# EAGLE design drone_V2 (EAGLE 7.5.0)
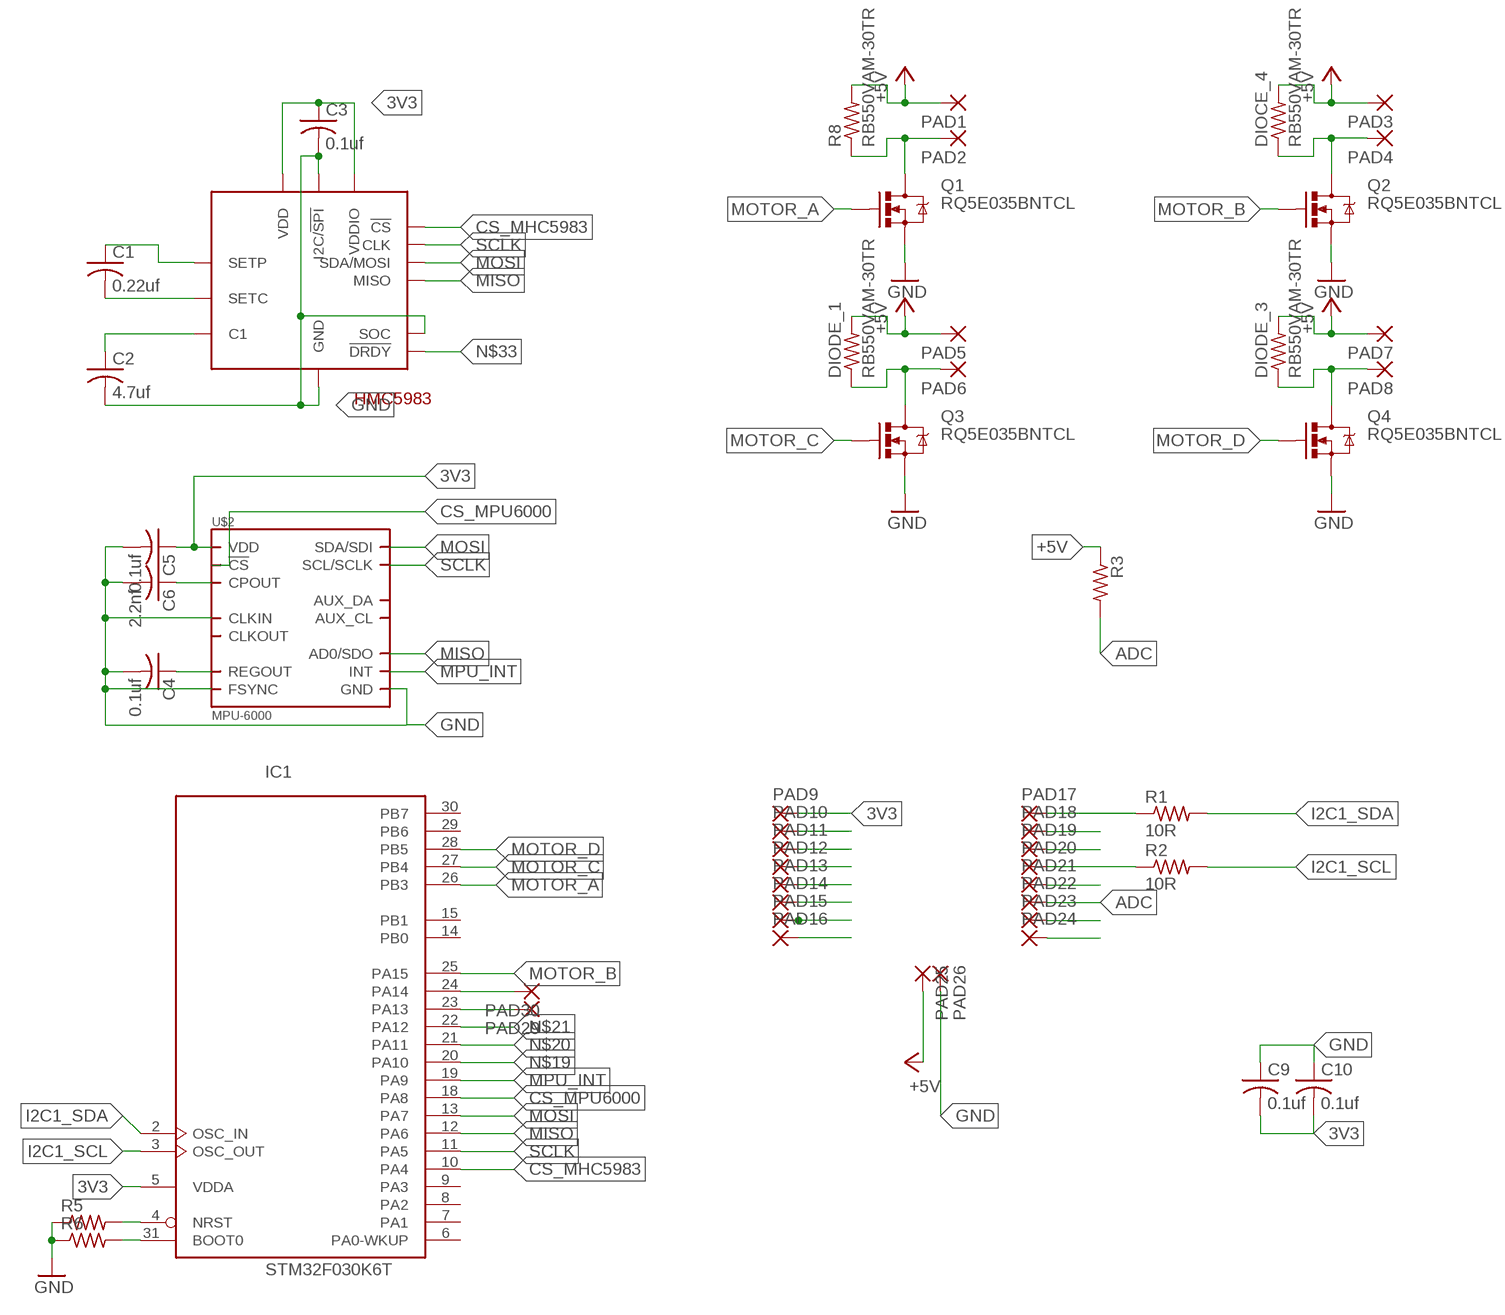
[diagram p0: schematic, sheet 1]

## Parts
C1  0.22uf  C-USC0805K  [C0805K]
C2  4.7uf  C-USC1206  [C1206]
C3  0.1uf  C-USC0805K  [C0805K]
C4  0.1uf  C-USC0805K  [C0805K]
C5  0.1uf  C-USC0805K  [C0805K]
C6  2.2nf  C-USC0805K  [C0805K]
C9  0.1uf  C-USC0805K  [C0805K]
C10  0.1uf  C-USC0805K  [C0805K]
DIOCE_4  RB550VAM-30TR  R-US_R0805  [R0805]
DIODE_1  RB550VAM-30TR  R-US_R0805  [R0805]
DIODE_3  RB550VAM-30TR  R-US_R0805  [R0805]
HMC5983  HMC5983  [LPCC16]
IC1  STM32F030K6T  [LQFP32]
PAD1  1,6/0,8  [1,6/0,8]
PAD2  1,6/0,8  [1,6/0,8]
PAD3  1,6/0,8  [1,6/0,8]
PAD4  1,6/0,8  [1,6/0,8]
PAD5  1,6/0,8  [1,6/0,8]
PAD6  1,6/0,8  [1,6/0,8]
PAD7  1,6/0,8  [1,6/0,8]
PAD8  1,6/0,8  [1,6/0,8]
PAD9  1,6/0,9  [1,6/0,9]
PAD10  1,6/0,9  [1,6/0,9]
PAD11  1,6/0,9  [1,6/0,9]
PAD12  1,6/0,9  [1,6/0,9]
PAD13  1,6/0,9  [1,6/0,9]
PAD14  1,6/0,9  [1,6/0,9]
PAD15  1,6/0,9  [1,6/0,9]
PAD16  1,6/0,9  [1,6/0,9]
PAD17  1,6/0,9  [1,6/0,9]
PAD18  1,6/0,9  [1,6/0,9]
PAD19  1,6/0,9  [1,6/0,9]
PAD20  1,6/0,9  [1,6/0,9]
PAD21  1,6/0,9  [1,6/0,9]
PAD22  1,6/0,9  [1,6/0,9]
PAD23  1,6/0,9  [1,6/0,9]
PAD24  1,6/0,9  [1,6/0,9]
PAD25  1,6/0,9  [1,6/0,9]
PAD26  1,6/0,9  [1,6/0,9]
PAD29  1,6/0,9  [1,6/0,9]
PAD30  1,6/0,9  [1,6/0,9]
Q1  RQ5E035BNTCL  MOSFET-NCHANNELSMD  [SOT23-3]
Q2  RQ5E035BNTCL  MOSFET-NCHANNELSMD  [SOT23-3]
Q3  RQ5E035BNTCL  MOSFET-NCHANNELSMD  [SOT23-3]
Q4  RQ5E035BNTCL  MOSFET-NCHANNELSMD  [SOT23-3]
R1  10R  R-US_R0805  [R0805]
R2  10R  R-US_R0805  [R0805]
R3  R-US_R0805  [R0805]
R5  R-US_R0805  [R0805]
R6  R-US_R0805  [R0805]
R8  RB550VAM-30TR  R-US_R0805  [R0805]
U$2  MPU-6000  [QFN.24.4X4]

## Nets
3V3: C3.1 C5.1 C9.2 C10.2 HMC5983.P$2(VDD) HMC5983.P$13(VDDIO) IC1.5(VDDA) PAD9.1(P) U$2.13(VDD)
+5V: DIOCE_4.2 DIODE_1.2 DIODE_3.2 PAD1.1(P) PAD3.1(P) PAD5.1(P) PAD7.1(P) PAD25.1(P) R3.1 R8.2
ADC: PAD22.1(P) R3.2
CS_MHC5983: HMC5983.P$4(!CS) IC1.10(PA4)
CS_MPU6000: IC1.18(PA8) U$2.8(!CS)
DIODE_2: PAD2.1(P) Q1.3(D) R8.1
GND: C2.2 C3.2 C4.2 C5.2 C6.2 C9.1 C10.1 HMC5983.P$6(I2C/!SPI) HMC5983.P$9(SOC) HMC5983.P$11(GND) PAD24.1(P) PAD26.1(P) Q1.2(S) Q2.2(S) Q3.2(S) Q4.2(S) R5.1 R6.1 U$2.1(CLKIN) U$2.11(FSYNC) U$2.18(GND)
I2C1_SCL: IC1.3(OSC_OUT) R2.2
I2C1_SDA: IC1.2(OSC_IN) R1.2
MISO: HMC5983.P$5(MISO) IC1.12(PA6) U$2.9(AD0/SDO)
MOSI: HMC5983.P$16(SDA/MOSI) IC1.13(PA7) U$2.24(SDA/SDI)
MOTOR_A: IC1.26(PB3) Q1.1(G)
MOTOR_B: IC1.25(PA15) Q2.1(G)
MOTOR_C: IC1.27(PB4) Q3.1(G)
MOTOR_D: IC1.28(PB5) Q4.1(G)
MPU_INT: IC1.19(PA9) U$2.12(INT)
N$3: DIODE_1.1 PAD6.1(P) Q3.3(D)
N$4: DIODE_3.1 PAD8.1(P) Q4.3(D)
N$5: DIOCE_4.1 PAD4.1(P) Q2.3(D)
N$6: IC1.4(NRST) R5.2
N$7: IC1.31(BOOT0) R6.2
N$8: PAD23.1(P)
N$11: C4.1 U$2.10(REGOUT)
N$13: PAD21.1(P)
N$14: PAD17.1(P) R1.1
N$15: PAD19.1(P)
N$16: PAD18.1(P)
N$17: PAD20.1(P) R2.1
N$18: PAD16.1(P)
N$19: IC1.20(PA10)
N$20: IC1.21(PA11)
N$21: IC1.22(PA12)
N$22: IC1.23(PA13) PAD29.1(P)
N$23: IC1.24(PA14) PAD30.1(P)
N$25: PAD15.1(P)
N$26: PAD14.1(P)
N$27: PAD13.1(P)
N$28: PAD12.1(P)
N$29: PAD11.1(P)
N$30: PAD10.1(P)
N$33: HMC5983.P$15(!DRDY)
N$35: C1.2 HMC5983.P$12(SETC)
N$36: C1.1 HMC5983.P$8(SETP)
N$38: C2.1 HMC5983.P$10(C1)
N$40: C6.1 U$2.20(CPOUT)
SCLK: HMC5983.P$1(CLK) IC1.11(PA5) U$2.23(SCL/SCLK)
Unconnected: IC1.6(PA0-WKUP) IC1.7(PA1) IC1.8(PA2) IC1.9(PA3) IC1.14(PB0) IC1.15(PB1) IC1.29(PB6) IC1.30(PB7) U$2.6(AUX_DA) U$2.7(AUX_CL) U$2.22(CLKOUT)

## Power pins joined to a net without a drawn wire
3V3: IC1.1(VDD) IC1.17(VDD)
GND: IC1.16(VSS) IC1.32(VSS)

## Library data of the parts
C1-C6 C9 C10 = adafruit:C-US: CAPACITOR, American symbol
DIOCE_4 DIODE_1 DIODE_3 R8 = adafruit:R-US_: RESISTOR, American symbol
HMC5983 = Oles komponentbibliotek:HMC5983: 3-Axis Digital Compass IC I²C up to 3.4 MHz and SPI up to 8.0 MHz 220 Hz Maximum Output Rate 2.16 to 3.6V, 100 μA Temperature compensated data output and temperature output 12-Bit ADC achieves 2 milli-gauss field resolution Wide Magnetic Field Range (+/-8 Oe)
IC1 = micro-stm_v3:STM32F030K*T: ARM 32-bit Cortex™-M0 CPU 48 MHz maximum frequency 32 Kbytes of Flash memory 4 kbytes of SRAM 26 GPIOs 2.4 to 3.6 V application supply
PAD1-PAD8 = wirepad_ext:1,6/0,8: THROUGH-HOLE PAD
PAD9-PAD26 PAD29 PAD30 = wirepad_ext:1,6/0,9: THROUGH-HOLE PAD
Q1-Q4 = SparkFun:MOSFET-NCHANNEL
R1-R3 R5 R6 = resistor:R-US_: RESISTOR, American symbol
U$2 = invensense:MPU-6000

## Board
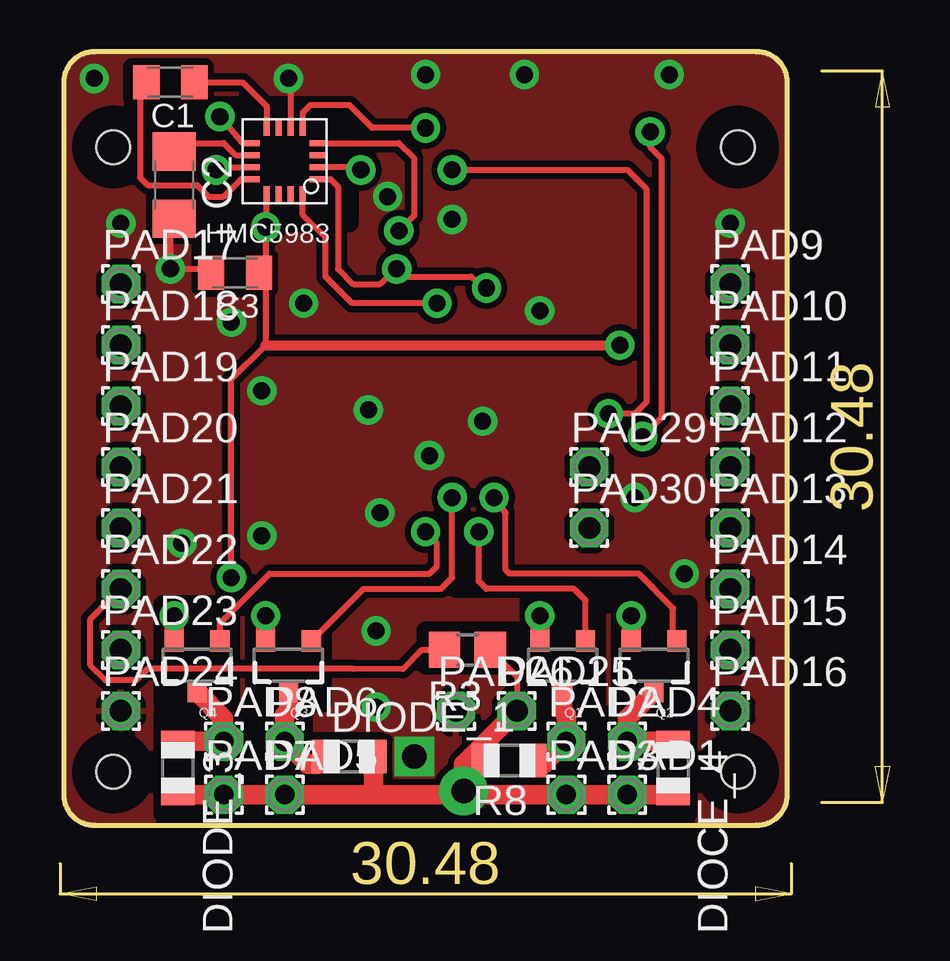
[diagram p1: board, top side]
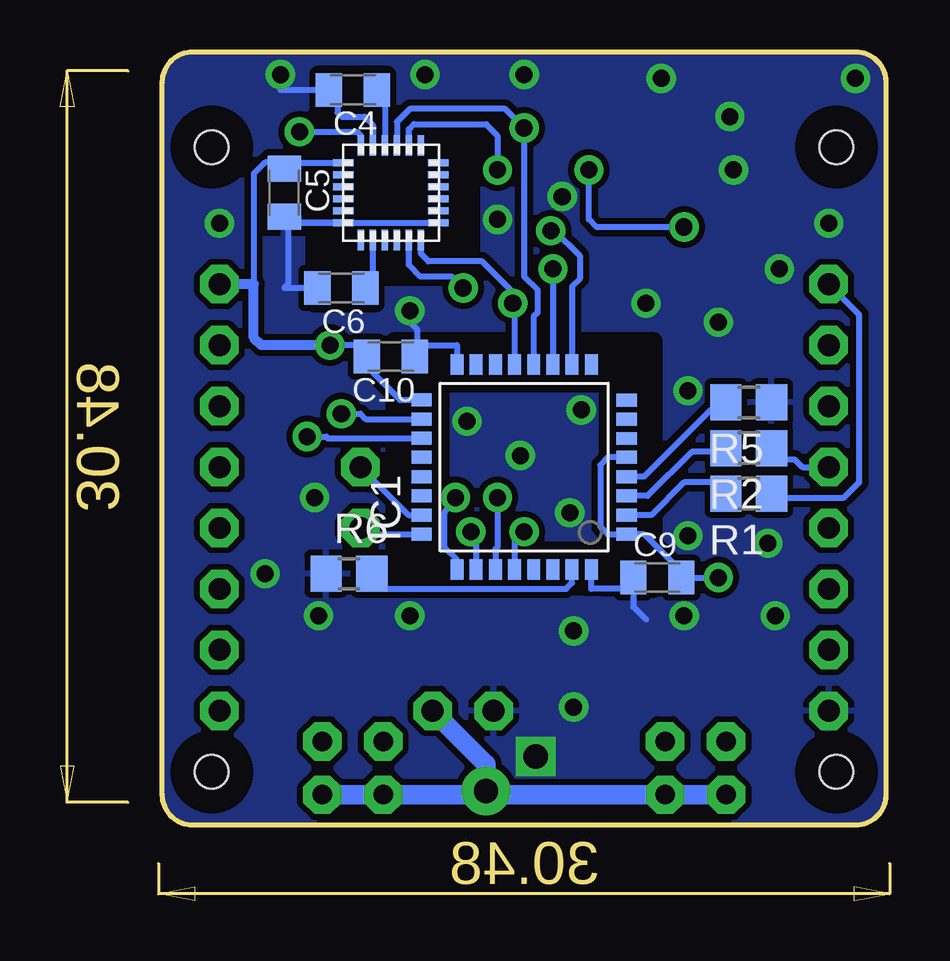
[diagram p2: board, bottom side, seen from below]

Size 34.59 x 34.59 mm. Coordinates in mm from the lower left corner, seen from the top.
Copper layers (1*16): Top 0.035mm / dielectric 1.5mm / Bottom 0.035mm
Design rules "default *": minimum track width 10mil, minimum drill 0.7mm, track to track 10mil, track to pad 10mil, pad to pad 10mil, via to via 10mil, smd to smd 10mil, copper to edge 40mil, drill to drill 8mil, minimum pad ring 10mil, minimum via ring 8mil, stop-mask expansion 4mil, vias tented up to drill 0mil, thermal gap 10mil
Holes 1.4 mm at 2.22,5.38 28.26,5.38 28.26,31.42 2.22,31.42
tRestrict: area 6.3,28.2 to 12.1,33.2; area 4,27.8 to 7.8,33; area 3,33.5 to 6,34.7; area 5.9,25.5 to 8.6,27.1; area 4.3,8.2 to 7.1,12.4; area 8.1,8.2 to 12.5,13.6; area 15.2,9.8 to 18.9,11.3; area 19.5,8.2 to 25.4,13.6; area 23.3,8.2 to 26.2,12.4; area 4.3,3.6 to 13.3,7.8; area 17.1,3.6 to 26.2,7.8; area 16.5,13 to 18.6,15.7; area 12.2,24.9 to 16.2,26.3; area 12.9,3.2 to 17.3,4
bRestrict: area 15.2,26 to 24,32.7; area 21,33.2 to 23.8,34.4; area 24.6,28.6 to 25.9,30.9; area 21.4,24.9 to 24,26.2; area 9.8,13 to 20.6,23.3; area 7,3.2 to 23.5,4
Milling: 8 lines

### Footprints (pad centres in the part's own frame; a part is rotated, then mirrored left to right if it is on the bottom)
C0805K = smd 1.1 x 1.4: 1 -1,0; 2 1,0
C1206 = smd 1.6 x 1.8: 1 -1.4,0; 2 1.4,0
R0805 = smd 1.1 x 1.4: 1 -1,0; 2 1,0
LPCC16 = smd 0.7 x 0.25: P$1 -1.4,0.7; P$2 -1.4,0.2; P$3 -1.4,-0.3; P$4 -1.4,-0.8; P$9 1.4,-0.8; P$10 1.4,-0.3; P$11 1.4,0.2; P$12 1.4,0.7 | smd 0.25 x 0.7: P$5 -0.75,-1.45; P$6 -0.25,-1.45; P$7 0.25,-1.45; P$8 0.75,-1.45; P$13 0.75,1.35; P$14 0.25,1.35; P$15 -0.25,1.35; P$16 -0.75,1.35
LQFP32 = smd 0.54 x 0.85: 1 -2.8,-4.275; 2 -2,-4.275; 3 -1.2,-4.275; 4 -0.4,-4.275; 5 0.4,-4.275; 6 1.19,-4.275; 7 1.99,-4.275; 8 2.79,-4.275; 17 2.8,4.275; 18 2,4.275; 19 1.2,4.275; 20 0.4,4.275; 21 -0.4,4.275; 22 -1.2,4.275; 23 -2,4.275; 24 -2.8,4.275 | smd 0.85 x 0.54: 9 4.275,-2.8; 10 4.275,-2; 11 4.275,-1.2; 12 4.275,-0.4; 13 4.275,0.4; 14 4.275,1.2; 15 4.275,2; 16 4.275,2.8; 25 -4.275,2.8; 26 -4.275,2; 27 -4.275,1.2; 28 -4.275,0.4; 29 -4.275,-0.4; 30 -4.275,-1.2; 31 -4.275,-2; 32 -4.275,-2.8
1,6/0,8 = drill 0.813 pad 1.6 octagon: 1 0,0
1,6/0,9 = drill 0.914 pad 1.6 octagon: 1 0,0
SOT23-3 = smd 0.8 x 0.9: 1 -0.95,-1; 2 0.95,-1; 3 0,1.1
R0805' = smd 1.3 x 1.5: 1 -0.95,0; 2 0.95,0
QFN.24.4X4 = smd 0.85 x 0.28: 1 -1.975,1.25; 2 -1.975,0.75; 3 -1.975,0.25; 4 -1.975,-0.25; 5 -1.975,-0.75; 6 -1.975,-1.25; 13 1.975,-1.25; 14 1.975,-0.75; 15 1.975,-0.25; 16 1.975,0.25; 17 1.975,0.75; 18 1.975,1.25 | smd 0.28 x 0.85: 7 -1.25,-1.975; 8 -0.75,-1.975; 9 -0.25,-1.975; 10 0.25,-1.975; 11 0.75,-1.975; 12 1.25,-1.975; 19 1.25,1.975; 20 0.75,1.975; 21 0.25,1.975; 22 -0.25,1.975; 23 -0.75,1.975; 24 -1.25,1.975

### Placement (x,y rotation side)
C1  4.6,34.11 180 top
C2  4.76,29.83 270 top
C3  7.3,26.18 180 top
C4  22.38,33.8 180 bottom
C5  25.24,29.51 270 bottom
C6  22.86,25.54 180 bottom
C9  9.68,13.48 0 bottom
C10  20.8,22.68 180 bottom
DIOCE_4  25.56,5.54 270 top
DIODE_1  12.06,6.02 0 top
DIODE_3  4.92,5.54 270 top
HMC5983  9.37,30.78 180 top
IC1  15.24,18.08 90 bottom
PAD1  23.65,4.43 0 top
PAD2  21.11,6.65 0 top
PAD3  21.11,4.43 0 top
PAD4  23.65,6.65 0 top
PAD5  9.37,4.43 0 top
PAD6  9.37,6.65 0 top
PAD7  6.83,4.43 0 top
PAD8  6.83,6.65 0 top
PAD9  27.94,25.7 0 top
PAD10  27.94,23.16 0 top
PAD11  27.94,20.62 0 top
PAD12  27.94,18.08 0 top
PAD13  27.94,15.54 0 top
PAD14  27.94,13 0 top
PAD15  27.94,10.46 0 top
PAD16  27.94,7.92 0 top
PAD17  2.54,25.7 0 top
PAD18  2.54,23.16 0 top
PAD19  2.54,20.62 0 top
PAD20  2.54,18.08 0 top
PAD21  2.54,15.54 0 top
PAD22  2.54,13 0 top
PAD23  2.54,10.46 0 top
PAD24  2.54,7.92 0 top
PAD25  19.05,7.92 0 top
PAD26  16.51,7.92 0 top
PAD29  22.07,18.08 0 top
PAD30  22.07,15.54 0 top
Q1  20.95,9.83 180 top
Q2  24.77,9.83 180 top
Q3  9.53,9.83 180 top
Q4  5.71,9.83 180 top
R1  10R  [R0805']  5.87,16.97 180 bottom
R2  10R  [R0805']  5.87,18.87 180 bottom
R3  [R0805']  16.99,10.46 180 top
R5  [R0805']  5.87,20.78 180 bottom
R6  [R0805']  22.54,13.64 0 bottom
R8  18.73,5.86 180 top
U$2  20.8,29.51 180 bottom

### Tracks (layer width: path | path; a pad name or v marks a point on that pad's centre or on a via)
3V3  (via drill 0.71 pad 1.22)
  Top 0.254: HMC5983.P$13 8.62,28.2 v8.57,28.08 8.57,26.34 8.3,26.38 C3.1 8.57,26.18 8.57,23.16 7.14,21.73 v7.14,13.48 | v12.54,30.46 12.42,30.58 HMC5983.P$2
  Top 0.406: 8.57,23.16 v23.34,23.16
  Bottom 0.254: v8.57,28.08 12.22,28.08 12.54,28.4 v12.54,30.46 | U$2.13 24.99,30.76 C5.1 25.51,30.78 26.04,30.78 26.51,30.3 26.51,25.7 | C9.2 8.89,13.95 10.22,15.28 IC1.1 11.75,15.28 12.06,15.6 12.06,18.16 11.75,18.48 IC1.5 | IC1.17 20.42,20.88 21.8,22.26 C10.2 22.27,23.16 v23.34,23.16 | C9.2 8.68,13.21 8.89,13 8.89,13.48 C9.2 | C9.2 v7.14,13.48
  Bottom 0.406: PAD9.1 26.51,25.7 26.51,23.48 26.19,23.16 v23.34,23.16
+5V  (via drill 1.02 pad 2.03)
  Top 0.254: R3.1 19.05,9.35 PAD25.1
  Top 0.61: 12.75,4.48 12.7,4.43
  Top 0.813: 16.83,4.43 13.18,4.43 | 13.18,4.43 12.7,4.43 PAD5.1 PAD7.1 4.87,4.43 DIODE_3.2 | PAD25.1 17.14,6.02 | 17.14,6.02 16.83,5.7 v16.83,4.59 16.83,4.43 | 16.83,4.43 PAD3.1 PAD1.1 25.45,4.43 DIOCE_4.2 | 17.14,6.02 17.46,5.7 17.62,5.86 R8.2 | DIODE_1.2 13.06,4.54 13.18,4.43
  Bottom 0.813: PAD25.1 16.83,5.7 v16.83,4.59 16.83,4.43 | 16.83,4.43 PAD7.1 | 16.83,4.43 PAD1.1
ADC
  Top 0.254: PAD22.1 1.27,11.73 1.27,9.83 1.91,9.19 3.17,9.19 3.65,9.67 12.22,9.67 14.29,9.66 15.08,10.46 R3.2
CS_MHC5983  (via drill 0.71 pad 1.22)
  Top 0.254: HMC5983.P$4 14.12,31.58 14.76,30.94 14.76,28.56 v14.13,27.92
  Bottom 0.254: v14.13,27.92 13.97,27.92 12.92,26.88 12.92,25.92 13.24,25.61 IC1.10
CS_MPU6000  (via drill 0.71 pad 1.22)
  Top 0.254: v16.35,30.46 23.65,30.46 24.45,29.67 24.45,20.78 23.97,20.3 v22.86,20.3
  Bottom 0.254: U$2.8 20.05,32.17 19.84,32.37 16.83,32.37 16.35,31.89 v16.35,30.46 | 19.58,20.14 IC1.18 21.84,20.08 22.07,20.3 v22.86,20.3
DIODE_2
  Top 0.254: Q1.3
  Top 0.813: Q1.3 20.95,7.92 21.11,7.76 PAD2.1 20.16,5.7 20,5.86 R8.1
GND  (via drill 0.71 pad 1.22, 1.02 pad 1.65)
  Top 0.254: v6.51,30.46 6.63,30.58 HMC5983.P$11 | v6.67,32.69 7.61,31.58 HMC5983.P$9 | v9.53,34.27 9.62,33.86 HMC5983.P$6 | C2.2 4.89,28.43 4.92,28.4 4.76,28.4 4.6,28.24 v4.6,26.34 6.19,26.34 6.3,26.45 | 6.3,26.45 6.3,26.65 | 6.3,26.45 C3.2 | v4.76,11.89 | v8.57,11.89 | v20,11.89 | v23.82,11.89 v23.81,11.89
  Top 0.813: Q4.2 v4.76,11.89 | Q3.2 v8.57,11.89 | Q1.2 v20,11.89 | Q2.2 v23.82,11.89
  Bottom 0.254: C5.2 24.99,28.26 U$2.18 | U$2.11 21.55,32.32 21.91,32.69 22.86,32.69 23.02,32.84 23.02,33.43 C4.2 25.4,33.8 v25.4,34.43 | U$2.18 U$2.1 | C9.1 10.68,13 | 10.68,13 12.44,13 IC1.32 | C10.1 19.68,22.68 19.68,23.16 | 19.68,23.16 18.04,23.16 IC1.16 | 19.68,23.16 19.68,23.8 20,24.11 v20,24.59 | 10.68,13 10.68,12.25 10.16,11.73 | U$2.18 25.06,28.26 25.08,28.24 25.08,25.7 25.24,25.54 C6.2
  other vias: 10.16,24.91 15.24,34.43 19.37,34.43 27.94,28.24 23.97,16.81 8.41,21.26 5.08,14.91 26.04,13.64 7.14,24.11 16.35,28.4 13.65,29.35 1.43,34.27 2.54,28.24 13.18,8.08 12.86,20.46 17.62,19.99 15.4,18.56 8.41,15.22 13.34,16.18 13.18,11.25 14.76,6.02
  pour Bottom (isolate 0.254): 28.89,3.32 1.59,3.32 arc-90 0.32,4.59 0.32,33.96 arc-90 1.59,35.23 28.89,35.23 arc-90 30.16,33.96 30.16,4.59 arc-90
  pour Top (isolate 0.254): 28.89,3.32 1.59,3.32 arc-90 0.32,4.59 0.32,33.96 arc-90 1.59,35.23 28.89,35.23 arc-90 30.16,33.96 30.16,4.59 arc-90
I2C1_SCL
  Bottom 0.254: R2.2 7.14,18.72 8.26,18.72 10.09,16.88 IC1.3
I2C1_SDA
  Bottom 0.254: R1.2 7.46,17.45 8.57,17.45 9.94,16.08 IC1.2
MISO  (via drill 0.71 pad 1.22)
  Top 0.254: v15.24,32.21 13.02,32.21 12.06,33.16 10.43,33.16 10.12,32.84 HMC5983.P$5
  Bottom 0.254: U$2.9 20.55,32.46 20,33 16.03,33 v15.24,32.21 15.24,26.02 14.68,25.46 14.68,24.51 14.84,24.35 IC1.12
MOSI  (via drill 0.71 pad 1.22)
  Top 0.254: v15.72,24.91 12.18,24.91 11.07,26.02 11.07,27.65 10.12,28.6 HMC5983.P$16
  Bottom 0.254: U$2.24 19.55,26.97 19.23,26.65 16.99,26.65 15.72,25.38 v15.72,24.91 15.64,24.83 IC1.13
MOTOR_A  (via drill 0.71 pad 1.22)
  Top 0.254: Q1.1 21.91,12.52 21.43,13 17.78,13 17.46,13.32 v17.46,15.38
  Bottom 0.254: v17.46,15.38 17.24,15.13 IC1.26
MOTOR_B  (via drill 0.71 pad 1.22)
  Top 0.254: Q2.1 25.56,10.98 25.56,12.21 24.13,13.64 18.73,13.64 18.57,13.79 18.57,16.18 v18.1,16.81
  Bottom 0.254: v18.1,16.81 18.57,16.18 18.57,14.75 18.04,14.21 IC1.25
MOTOR_C  (via drill 0.71 pad 1.22)
  Top 0.254: Q3.1 12.65,13 15.88,13 16.35,13.48 v16.35,16.81
  Bottom 0.254: v16.35,16.81 16.35,14.75 16.44,14.66 IC1.27
MOTOR_D  (via drill 0.71 pad 1.22)
  Top 0.254: Q4.1 6.67,11.57 8.73,13.64 15.4,13.64 15.72,13.95 15.72,14.91 v15.24,15.38
  Bottom 0.254: v15.24,15.38 15.64,14.98 IC1.28
MPU_INT  (via drill 0.71 pad 1.22)
  Top 0.254: v24.61,32.05 24.61,31.42 25.08,30.94 25.08,20.14 v24.29,19.35
  Bottom 0.254: v24.61,32.05 22.2,32.05 22.05,31.89 U$2.12 | 19.59,19.35 IC1.19 23.43,19.28 23.5,19.35 v24.29,19.35
N$1
  pour Bottom (isolate 0.305): 12.06,21.26 18.41,21.26 18.41,16.81 16.67,16.81 15.24,15.38 15.24,14.91 12.06,14.91
N$3
  Top 0.813: Q3.3 9.53,7.92 9.37,7.76 PAD6.1 10.32,5.7 10.75,5.7 DIODE_1.1
N$4
  Top 0.254: Q4.3
  Top 0.813: Q4.3 6.83,7.6 PAD8.1 4.87,6.65 DIODE_3.1
N$5
  Top 0.813: Q2.3 23.65,7.61 PAD4.1 25.45,6.65 DIOCE_4.1
N$6
  Bottom 0.254: R5.2 7.3,20.46 7.46,20.46 10.24,17.68 IC1.4
N$7
  Bottom 0.254: R6.2 21.27,13.32 21.27,13.16 21.11,13 13.49,13 13.24,13.25 IC1.31
N$11
  Bottom 0.254: C4.1 21.05,33.46 U$2.10
N$14
  Bottom 0.254: R1.1 5.4,16.81 1.91,16.81 1.27,17.45 1.27,24.43 PAD17.1
N$17
  Bottom 0.254: R2.1 5.4,18.4 3.97,18.4 3.65,18.08 PAD20.1
N$22
  Bottom 0.254: PAD29.1 20.07,16.08 IC1.23
N$23
  Bottom 0.254: PAD30.1 21.81,15.28 IC1.24
N$35
  Top 0.254: C1.2 3.65,33.96 3.33,33.96 3.33,30.15 3.65,29.83 5.71,29.83 6.19,29.35 6.83,29.35 7.55,30.08 HMC5983.P$12
N$36
  Top 0.254: C1.1 7.62,34.11 8.62,33.12 HMC5983.P$8
N$38
  Top 0.254: C2.1 5.37,31.57 6.83,31.57 7.32,31.08 HMC5983.P$10
N$40
  Bottom 0.254: C6.1 21.55,25.86 U$2.20
SCLK  (via drill 0.71 pad 1.22)
  Top 0.254: HMC5983.P$1 11.27,30.08 11.59,29.76 11.59,26.34 12.22,25.7 13.34,25.7 13.97,26.34 v14.04,26.34 14.36,26.02 17.14,26.02 v17.78,25.54
  Bottom 0.254: v14.04,26.34 IC1.11 | v17.78,25.54 18.26,26.02 19.57,26.02 20.05,26.49 U$2.23

### Text on the board
tNames: Phoenix Drone